# Altium project Project_20160953.PrjPcb
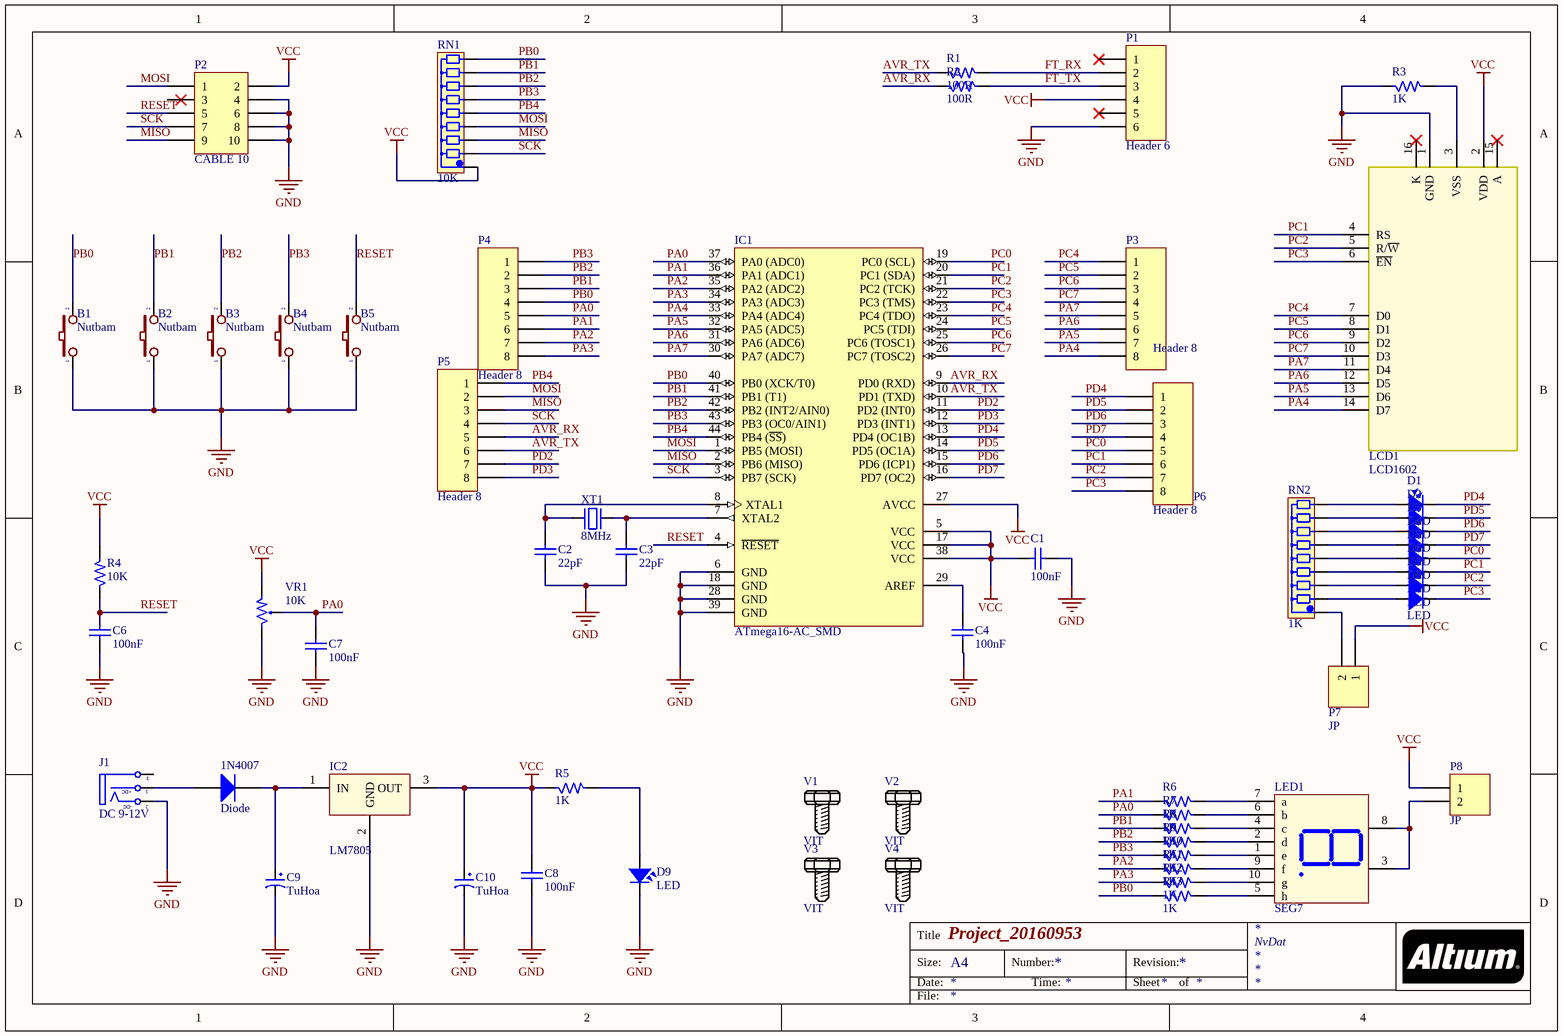
[diagram p0: SCH.SchDoc]
1 sheet, 58 parts. Net scope: global (net labels, ports and power ports of the same name join across sheets).
Board file: PCB2_AVR.PcbDoc

## Sheet SCH.SchDoc: Project_20160953
size A4; CompanyName: Nguyen Vu Dat; Engineer: NvDat; Address1: NvDat

### Parts
1N4007  Diode  [D - SMA2 (DO-214AC)_ SS34/SS14 -3A-0.5V]
B1  Nutbam  [SW-SMD- 6x3.7 mm]
B2  Nutbam  [SW-SMD- 6x3.7 mm]
B3  Nutbam  [SW-SMD- 6x3.7 mm]
B4  Nutbam  [SW-SMD- 6x3.7 mm]
B5  Nutbam  [SW-SMD- 6x3.7 mm]
C1  100nF  [C 0805]
C2  22pF  [C 0805]
C3  22pF  [C 0805]
C4  100nF  [C 0805]
C6  100nF  [C 0805]
C7  100nF  [C 0805]
C8  100nF  [C 0805]
C9  TuHoa  [C ALU-CODE - F/O_10X10.2]
C10  TuHoa  [C ALU-CODE - F/O_10X10.2]
D1  LED  [LED 0805 - do]
D2  LED  [LED 0805 - do]
D3  LED  [LED 0805 - do]
D4  LED  [LED 0805 - do]
D5  LED  [LED 0805 - do]
D6  LED  [LED 0805 - do]
D7  LED  [LED 0805 - do]
D8  LED  [LED 0805 - do]
D9  LED  [LED 0805 - do]
IC1  ATmega16-AC_SMD  [ATmega16]
IC2  LM7805  [TO252- LM7805]
J1  DC 9-12V  [DC-IN]
LCD1  LCD1602  [LCD16X2 - duplicate]
LED1  SEG7  [LED 7SEGS - Body 12 x 15 mm]
P1  Header 6  [HDR1X6]
P2  CABLE 10  [CABLE 10]
P3  Header 8  [HDR1X8]
P4  Header 8  [HDR1X8]
P5  Header 8  [HDR1X8]
P6  Header 8  [HDR1X8]
P7  JP  [HDR1X2]
P8  JP  [HDR1X2]
R1  100R  [R 0805]
R2  100R  [R 0805]
R3  1K  [R 0805]
R4  10K  [R 0805]
R5  1K  [R 0805]
R6  1K  [R 0805]
R7  1K  [R 0805]
R8  1K  [R 0805]
R9  1K  [R 0805]
R10  1K  [R 0805]
R11  1K  [R 0805]
R12  1K  [R 0805]
R13  1K  [R 0805]
RN1  10K  [RN8]
RN2  1K  [RN8]
V1  VIT  [via]
V2  VIT  [via]
V3  VIT  [via]
V4  VIT  [via]
VR1  10K  [RV TRIM-3296]
XT1  8MHz  [CRYSTAL 12MHZ-SMD]

### Nets
GND: B1.1 B2.1 B3.1 B4.1 B5.1 C1.2 C2.1 C3.1 C4.2 C6.2 C7.1 C8.1 C9.2 C10.2 D9.2 IC1.6(GND) IC1.18(GND) IC1.28(GND) IC1.39(GND) IC2.2(GND) J1.2(TN) LCD1.1(GND) P1.6 P2.4 P2.6 P2.8 P2.10 R3.1 VR1.3
VCC: C1.1 C8.2 C10.1 IC1.5(VCC) IC1.17(VCC) IC1.27(AVCC) IC1.38(VCC) IC2.3(OUT) LCD1.2(VDD) P1.4 P2.2 P7.1 P8.1 R4.2 R5.1 RN1.1 VR1.1
AVR_RX: IC1.9(PD0_(RXD)) P5.5 R2.1
AVR_TX: IC1.10(PD1_(TXD)) P5.6 R1.1
FT_RX: P1.2 R1.2
FT_TX: P1.3 R2.2
MISO: IC1.2(PB6_(MISO)) P2.9 P5.3 RN1.3
MOSI: IC1.1(PB5_(MOSI)) P2.1 P5.2 RN1.4
PA0: C7.2 IC1.37(PA0_(ADC0)) P4.5 R7.1 VR1.2
PA1: IC1.36(PA1_(ADC1)) P4.6 R6.1
PA2: IC1.35(PA2_(ADC2)) P4.7 R11.1
PA3: IC1.34(PA3_(ADC3)) P4.8 R12.1
PA4: IC1.33(PA4_(ADC4)) LCD1.14(D7) P3.8
PA5: IC1.32(PA5_(ADC5)) LCD1.13(D6) P3.7
PA6: IC1.31(PA6_(ADC6)) LCD1.12(D5) P3.6
PA7: IC1.30(PA7_(ADC7)) LCD1.11(D4) P3.5
PB0: B1.2 IC1.40(PB0_(XCK/T0)) P4.4 R13.1 RN1.9
PB1: B2.2 IC1.41(PB1_(T1)) P4.3 R8.1 RN1.8
PB2: B3.2 IC1.42(PB2_(INT2/AIN0)) P4.2 R9.1 RN1.7
PB3: B4.2 IC1.43(PB3_(OC0/AIN1)) P4.1 R10.1 RN1.6
PB4: IC1.44(PB4_(~{SS})) P5.1 RN1.5
PC0: D5.2 IC1.19(PC0_(SCL)) P6.5
PC1: D6.2 IC1.20(PC1_(SDA)) LCD1.4(RS) P6.6
PC2: D7.2 IC1.21(PC2_(TCK)) LCD1.5(R/~{W}) P6.7
PC3: D8.2 IC1.22(PC3_(TMS)) LCD1.6(~{EN}) P6.8
PC4: IC1.23(PC4_(TDO)) LCD1.7(D0) P3.1
PC5: IC1.24(PC5_(TDI)) LCD1.8(D1) P3.2
PC6: IC1.25(PC6_(TOSC1)) LCD1.9(D2) P3.3
PC7: IC1.26(PC7_(TOSC2)) LCD1.10(D3) P3.4
PD2: IC1.11(PD2_(INT0)) P5.7
PD3: IC1.12(PD3_(INT1)) P5.8
PD4: D1.2 IC1.13(PD4_(OC1B)) P6.1
PD5: D2.2 IC1.14(PD5_(OC1A)) P6.2
PD6: D3.2 IC1.15(PD6_(ICP1)) P6.3
PD7: D4.2 IC1.16(PD7_(OC2)) P6.4
RESET: B5.2 C6.1 IC1.4(~{RESET}) P2.5 R4.1
SCK: IC1.3(PB7_(SCK)) P2.7 P5.4 RN1.2
Net1N4007_1: 1N4007.1(A) J1.1(T)
Net1N4007_2: 1N4007.2(K) C9.1 IC2.1(IN)
NetC2_2: C2.2 IC1.8(XTAL1) XT1.1
NetC3_2: C3.2 IC1.7(XTAL2) XT1.2
NetC4_1: C4.1 IC1.29(AREF)
NetD1_1: D1.1 RN2.9
NetD2_1: D2.1 RN2.8
NetD3_1: D3.1 RN2.7
NetD4_1: D4.1 RN2.6
NetD5_1: D5.1 RN2.5
NetD6_1: D6.1 RN2.4
NetD7_1: D7.1 RN2.3
NetD8_1: D8.1 RN2.2
NetD9_1: D9.1 R5.2
NetLCD1_3: LCD1.3(VSS) R3.2
NetLED1_1: LED1.1(e) R10.2
NetLED1_2: LED1.2(d) R9.2
NetLED1_3: LED1.3(Vcc) LED1.8(Vcc) P8.2
NetLED1_4: LED1.4(c) R8.2
NetLED1_5: LED1.5(h) R13.2
NetLED1_6: LED1.6(b) R7.2
NetLED1_7: LED1.7(a) R6.2
NetLED1_9: LED1.9(f) R11.2
NetLED1_10: LED1.10(g) R12.2
NetP7_2: P7.2 RN2.1

Not connected (* = marked no-connect by the designer): J1 3(S); LCD1 15(A)* 16(K)*; P1 1* 5*; P2 3; V1 1; V2 1; V3 1; V4 1

### Notes on the sheet
- Text
- Title
- Size:
- Date:
- A4
- Number:
- Time:
- Revision:
- Sheet
- of
- File:
- (in symbol DCIN) +DC; -DC

### Library data of the parts
C1-C4 C6-C8 = TuGom
IC1 = ATmega16-AC_SMD: 8-Bit AVR Microcontroller with 16K Bytes of In-System Programmable Flash Memory; Published: 17-Sep-2003; LatestRevisionDate: 13-Apr-2006; LatestRevisionNote: IPC-7351 Footprint Added.; DatasheetVersion: 2466E-AVR-10/02; PackageVersion: rev.B, Oct-2001; PackageReference: 44A; Publisher: Altium Limited; PackageDescription: 44-Pin Thin Quad Flat Pack 0.8 mm Pitch; ComponentLink1Description: Manufacturer Link; ComponentLink1URL: http://www.atmel.com; ComponentLink2Description: Datasheet; ComponentLink2URL: http://www.atmel.com/dyn/resources/prod_documents/doc2466.pdf
J1 = DCIN: Jack DC input; Value: Jac DC
P1 = Header 6: Header, 6-Pin; LatestRevisionDate: 17-Jul-2002; LatestRevisionNote: Re-released for DXP Platform.; Publisher: Altium Limited
P2 = CABLE 10: Header, 5-Pin, Dual row; LatestRevisionDate: 17-Jul-2002; LatestRevisionNote: Re-released for DXP Platform.; Publisher: Altium Limited
P3-P6 = Header 8: Header, 8-Pin; LatestRevisionDate: 17-Jul-2002; LatestRevisionNote: Re-released for DXP Platform.; Publisher: Altium Limited
P7 P8 = Header 2: Header, 2-Pin; LatestRevisionDate: 17-Jul-2002; LatestRevisionNote: Re-released for DXP Platform.; Publisher: Altium Limited
R1-R13 = R
RN1 RN2 = TroBang
V1-V4 = VIT: 3.5MM
VR1 = BienTro
XT1 = ThachAnh